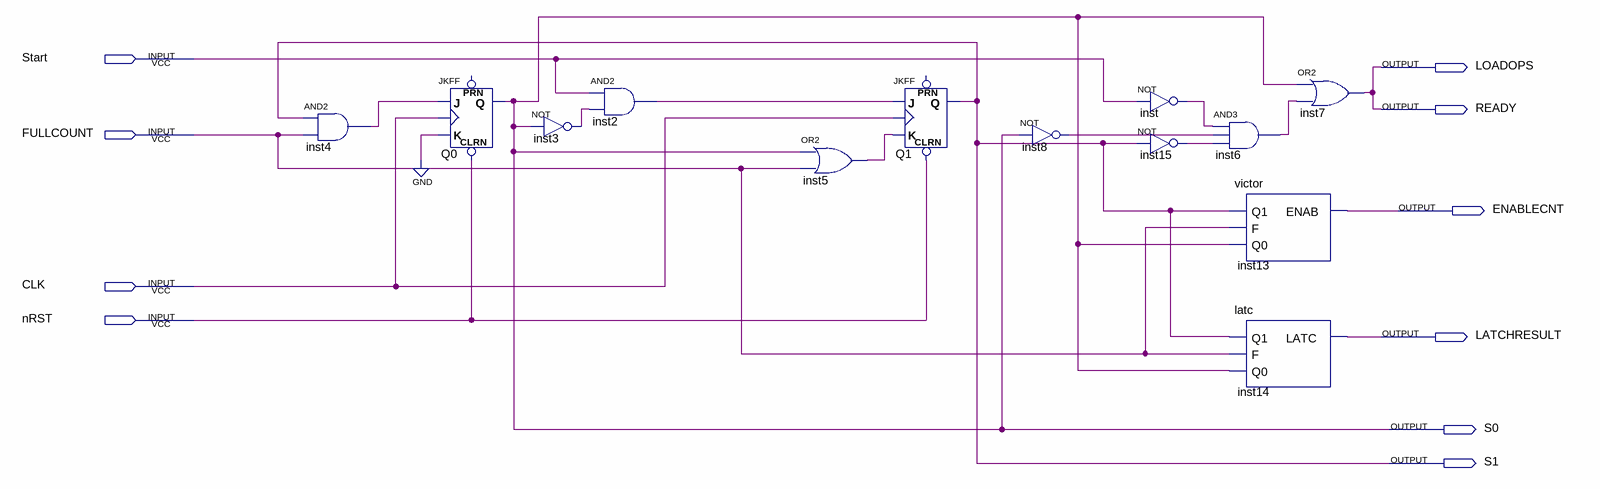
[diagram p0: schematic sheet]
// Quartus schematic sm2.bdf as structural Verilog: 13 symbols, 10 pins
module sm2 (
  input  Start,
  input  FULLCOUNT,
  input  CLK,
  input  nRST,
  output LOADOPS,
  output READY,
  output ENABLECNT,
  output LATCHRESULT,
  output S0,
  output S1
);

  wire inst2_out, inst3_out, inst4_out, inst5_out, inst6_out, inst8_out, inst15_out, inst_out;

  and inst4 (inst4_out, S1, FULLCOUNT);
  JKFF Q0 (.CLRN(nRST), .K(1'b0), .J(inst4_out), .CLK(CLK), .Q(S0));  // open: PRN
  and inst2 (inst2_out, Start, inst3_out);
  not inst3 (inst3_out, S0);
  or inst5 (inst5_out, S0, FULLCOUNT);
  JKFF Q1 (.CLRN(nRST), .K(inst5_out), .J(inst2_out), .CLK(CLK), .Q(S1));  // open: PRN
  not inst8 (inst8_out, S0);
  not inst (inst_out, Start);
  not inst15 (inst15_out, S1);
  and inst6 (inst6_out, inst_out, inst8_out, inst15_out);
  victor inst13 (.Q1(S1), .F(FULLCOUNT), .Q0(S0), .ENAB(ENABLECNT));
  latc inst14 (.Q1(S1), .F(FULLCOUNT), .Q0(S0), .LATC(LATCHRESULT));
  or inst7 (LOADOPS, S0, inst6_out);

  assign READY = LOADOPS;
endmodule
